# EAGLE schematic MSP430FR2433_SMD_0603 (EAGLE 7.5.0)
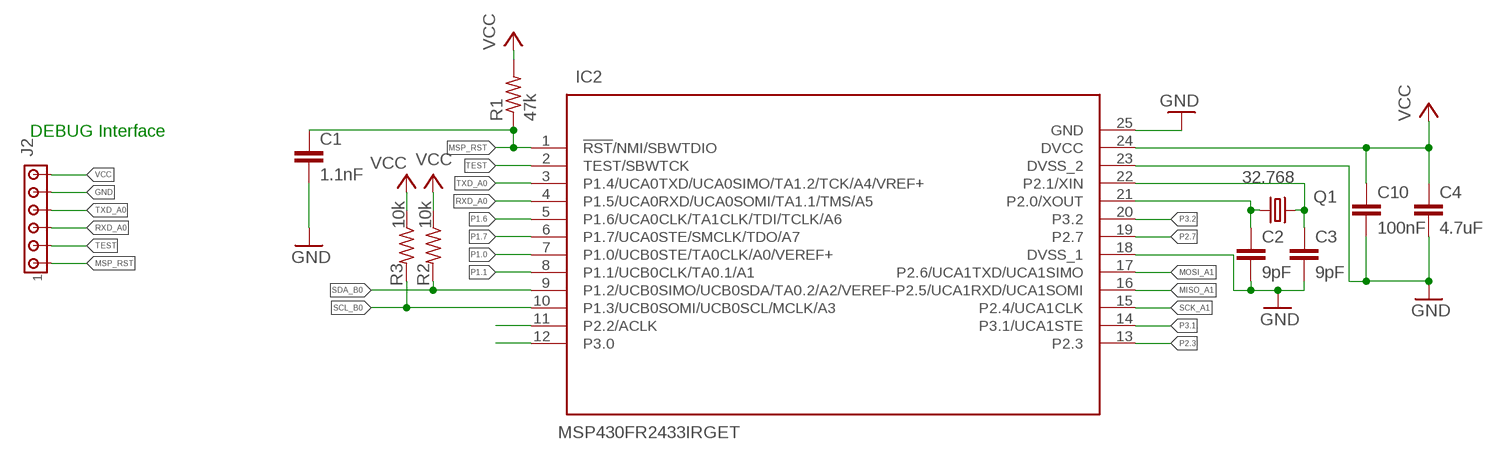
[diagram p0: schematic, sheet 1]

## Parts
C1  1.1nF  C-EUC0402  [C0402]
C2  9pF  C-EUC0402  [C0402]
C3  9pF  C-EUC0402  [C0402]
C4  4.7uF  C-EUC0402  [C0402]
C10  100nF  C-EUC0402  [C0402]
IC2  MSP430FR2433IRGET  [QFN50P400X400X100-25N]
J2  MTA06-100  [10X06MTA]
Q1  32.768  CRYTALTC26H  [TC26H]
R1  47k  R-US_R0402  [R0402]
R2  10k  R-US_R0402  [R0402]
R3  10k  R-US_R0402  [R0402]

## Nets
GND: C1.2 C2.2 C3.2 C4.2 C10.2 IC2.18(DVSS_1) IC2.23(DVSS_2) IC2.25(GND) J2.5
MISO_A1: IC2.16(P2.5/UCA1RXD/UCA1SOMI)
MOSI_A1: IC2.17(P2.6/UCA1TXD/UCA1SIMO)
MSP_RST: C1.1 IC2.1(!RST!/NMI/SBWTDIO) J2.1 R1.1
N$1: C2.1 IC2.21(P2.0/XOUT) Q1.1
N$3: C3.1 IC2.22(P2.1/XIN) Q1.2
N$13: IC2.11(P2.2/ACLK)
N$14: IC2.12(P3.0)
P1.0: IC2.7(P1.0/UCB0STE/TA0CLK/A0/VEREF+)
P1.1: IC2.8(P1.1/UCB0CLK/TA0.1/A1)
P1.6: IC2.5(P1.6/UCA0CLK/TA1CLK/TDI/TCLK/A6)
P1.7: IC2.6(P1.7/UCA0STE/SMCLK/TDO/A7)
P2.3: IC2.13(P2.3)
P2.7: IC2.19(P2.7)
P3.1: IC2.14(P3.1/UCA1STE)
P3.2: IC2.20(P3.2)
RXD_A0: IC2.4(P1.5/UCA0RXD/UCA0SOMI/TA1.1/TMS/A5) J2.3
SCK_A1: IC2.15(P2.4/UCA1CLK)
SCL_B0: IC2.10(P1.3/UCB0SOMI/UCB0SCL/MCLK/A3) R3.2
SDA_B0: IC2.9(P1.2/UCB0SIMO/UCB0SDA/TA0.2/A2/VEREF-) R2.2
TEST: IC2.2(TEST/SBWTCK) J2.2
TXD_A0: IC2.3(P1.4/UCA0TXD/UCA0SIMO/TA1.2/TCK/A4/VREF+) J2.4
VCC: C4.1 C10.1 IC2.24(DVCC) J2.6 R1.2 R2.1 R3.1

## Notes on the sheet
- DEBUG Interface

## Library data of the parts
C1-C4 C10 = rcl:C-EU: CAPACITOR, European symbol
IC2 = MSP430fr24333:MSP430FR2433IRGET: 16-bit Microcontrollers - MCU 16 MHz Ultra-Low-Power Microcontroller with 16 KB FRAM, 4 KB RAM, 10-bit ADC, 19 IO, 4 16-bit Timers 24-VQFN -40 to 85 Source: Datasheet <http://www.ti.com/lit/ds/symlink/msp430fr2433.pdf>; DESCRIPTION: 16-bit Microcontrollers - MCU 16 MHz Ultra-Low-Power Microcontroller with 16 KB FRAM, 4 KB RAM, 10-bit ADC, 19 IO, 4 16-bit Timers 24-VQFN -40 to 85; HEIGHT: 1mm; MANUFACTURER_NAME: Texas Instruments; MANUFACTURER_PART_NUMBER: MSP430FR2433IRGET; MOUSER_PART_NUMBER: 595-SP430FR2433IRGET; MOUSER_PRICE-STOCK: https://www.mouser.co.uk/ProductDetail/Texas-Instruments/MSP430FR2433IRGET?qs=bY1dm4K8r4WBEjjMCxA0VQ%3D%3D
J2 = con-amp:MTA06-100: AMP connector Connection corrected 2014-09-19
Q1 = crystal:CRYTAL: CRYSTAL
R1-R3 = rcl:R-US_: RESISTOR, American symbol